# EAGLE design gpi-top (EAGLE 7.1.0)
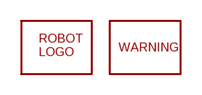
[diagram p0: schematic, sheet 1]

## Parts
U$1  ROBOTMAN-LOGO  [ROBOTMAN-LOGO]
U$2  SYMBOL-WARNING  [SYMBOL-WARNING]

## Library data of the parts
U$1 = jaw:ROBOTMAN-LOGO
U$2 = jaw:SYMBOL-WARNING

## Board
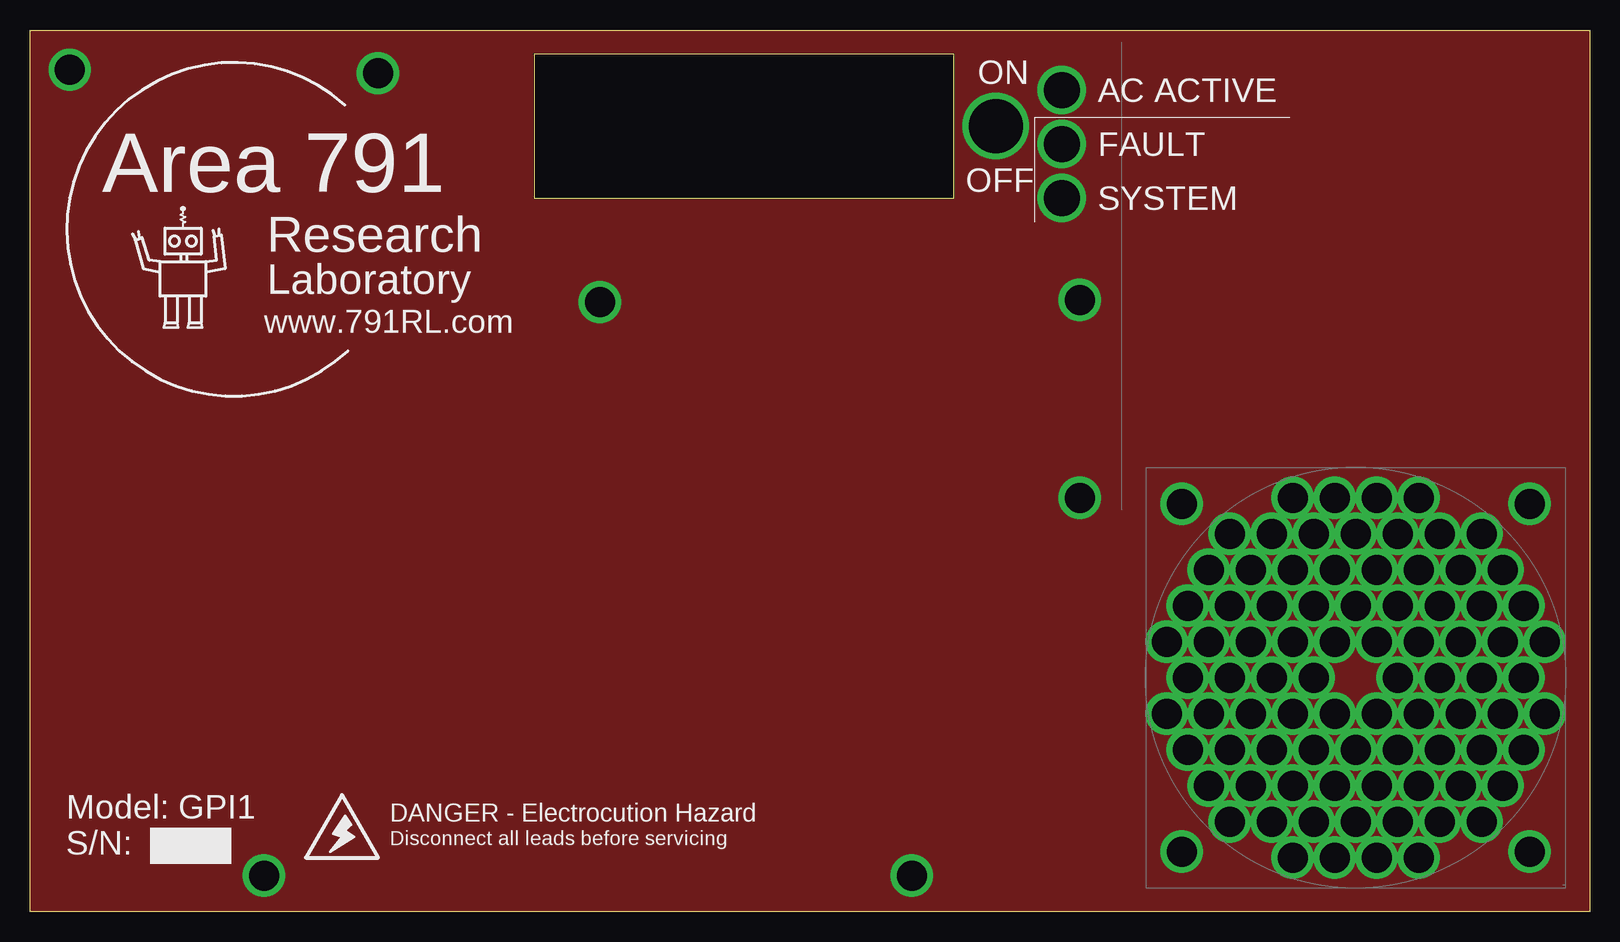
[diagram p1: board, top side]
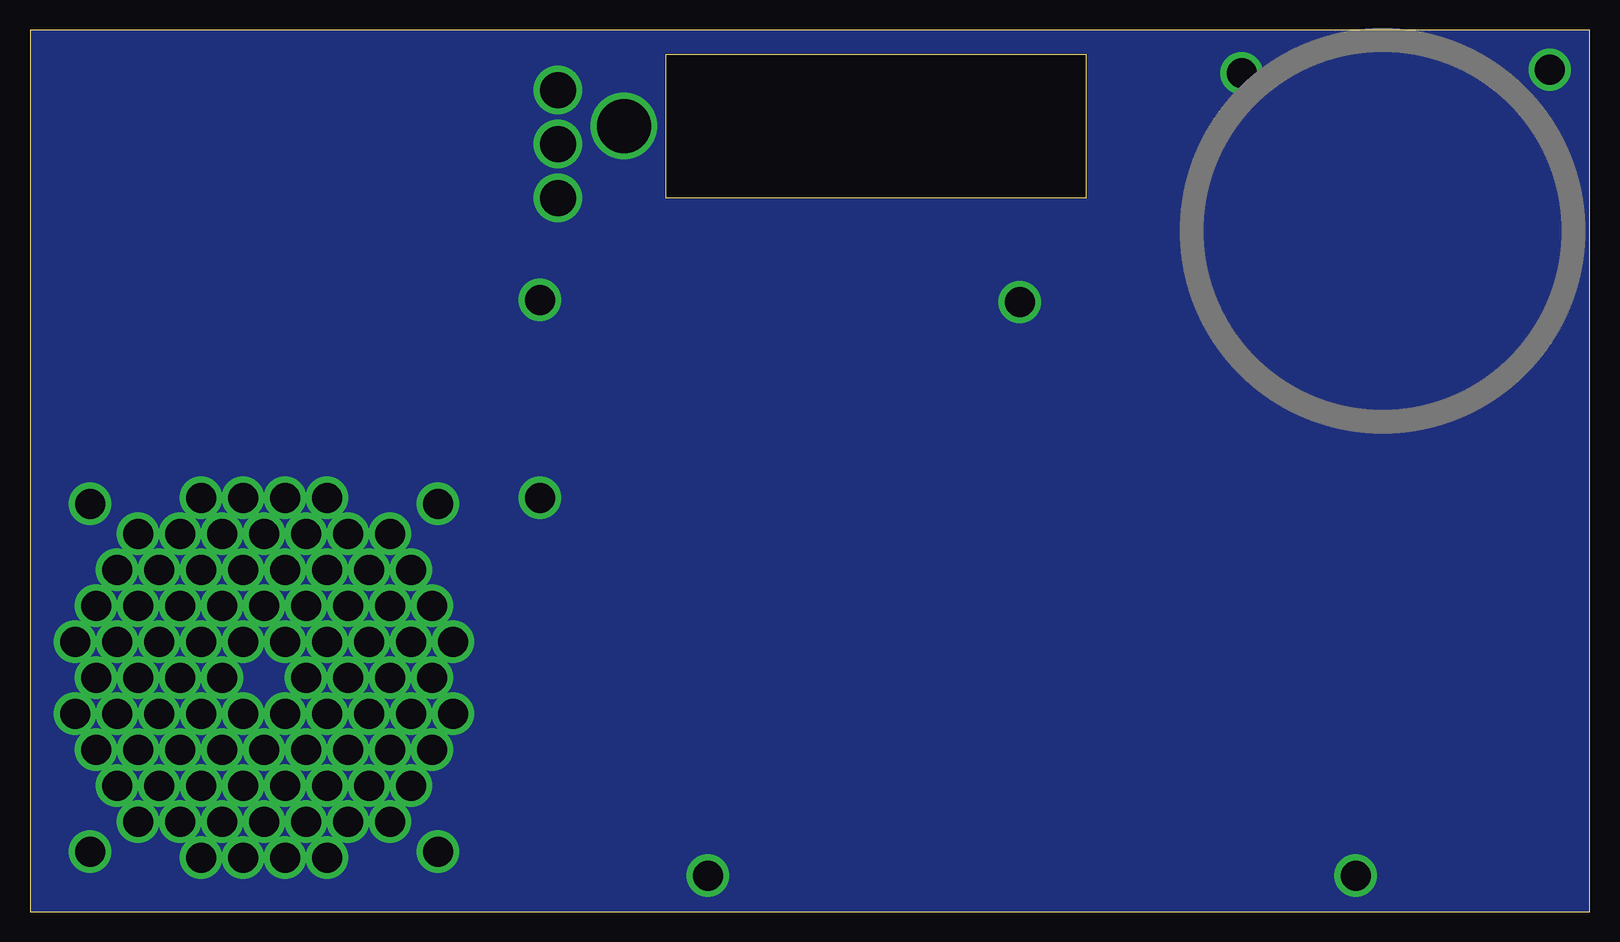
[diagram p2: board, bottom side, seen from below]

Size 130 x 73.5 mm. Coordinates in mm from the lower left corner, seen from the top.
Outline: 130,73.5 130,0 0,0 0,73.5 130,73.5
Outline: 77,59.5 77,71.5 42,71.5 42,59.5 77,59.5
Copper layers (1*16): Top 0.035mm / dielectric 1.5mm / Bottom 0.035mm
Design rules "default *": minimum track width 0.25mm, minimum drill 24mil, track to track 8mil, track to pad 8mil, pad to pad 8mil, via to via 8mil, smd to smd 8mil, copper to edge 1mil, drill to drill 8mil, minimum pad ring 10mil, minimum via ring 8mil, stop-mask expansion 4mil, vias tented up to drill 0mil, thermal gap 10mil

### Placement (x,y rotation side)
U$1  12.75,53 0 top
U$2  26,6.5 0 top

### Tracks (layer width: path | path; a pad name or v marks a point on that pad's centre or on a via)
S$1  (via drill 2.5, 3, 4.5)
  other vias: 73.5,3 29,69.9 47.5,50.8 80.5,65.5 86,68.5 86,64 86,59.5 87.5,51 19.5,3 87.5,34.5 96,34 125,34 96,5 125,5 108.75,16.5 124.5,13.5 110.5,13.5 115.75,16.5 94.75,16.5 100,13.5 100,19.5 100,25.5 100,31.5 100,7.5 101.75,10.5 101.75,16.5 101.75,22.5 101.75,28.5 103.5,13.5 103.5,19.5 103.5,25.5 103.5,31.5 103.5,7.5 105.25,10.5 105.25,16.5 105.25,22.5 105.25,28.5 105.25,34.5 105.25,4.5 107,13.5 107,19.5 107,25.5 107,31.5 107,7.5 108.75,10.5 108.75,22.5 108.75,28.5 108.75,34.5 108.75,4.5 110.5,25.5 110.5,31.5 110.5,7.5 112.25,10.5 112.25,16.5 112.25,22.5 112.25,28.5 112.25,34.5 112.25,4.5 114,13.5 114,19.5 114,25.5 114,31.5 114,7.5 115.75,10.5 115.75,22.5 115.75,28.5 115.75,34.5 115.75,4.5 117.5,13.5 117.5,19.5 117.5,25.5 117.5,31.5 117.5,7.5 119.25,10.5 119.25,16.5 119.25,22.5 119.25,28.5 121,13.5 121,19.5 121,25.5 121,31.5 121,7.5 122.75,10.5 122.75,16.5 122.75,22.5 122.75,28.5 124.5,19.5 124.5,25.5 126.25,16.5 126.25,22.5 94.75,22.5 96.5,13.5 96.5,19.5 96.5,25.5 98.25,10.5 98.25,16.5 98.25,22.5 98.25,28.5 3.3,70.2
  pour Bottom: -1,74 131,74 131,-1 -1,-1
  pour Top: -1,74 131,74 131,-1 -1,-1

### Text on the board
tPlace: ON | AC ACTIVE | FAULT | Area 791 | OFF | SYSTEM | Research | Laboratory | www.791RL.com | DANGER - Electrocution Hazard | Disconnect all leads before servicing | Model: GPI1 / S/N: